# EAGLE schematic am-1801 (EAGLE 6.4)
AUTHOR: Brad Campbell; REV: B; TITLE: Impulse

## Sheet 1 of 2
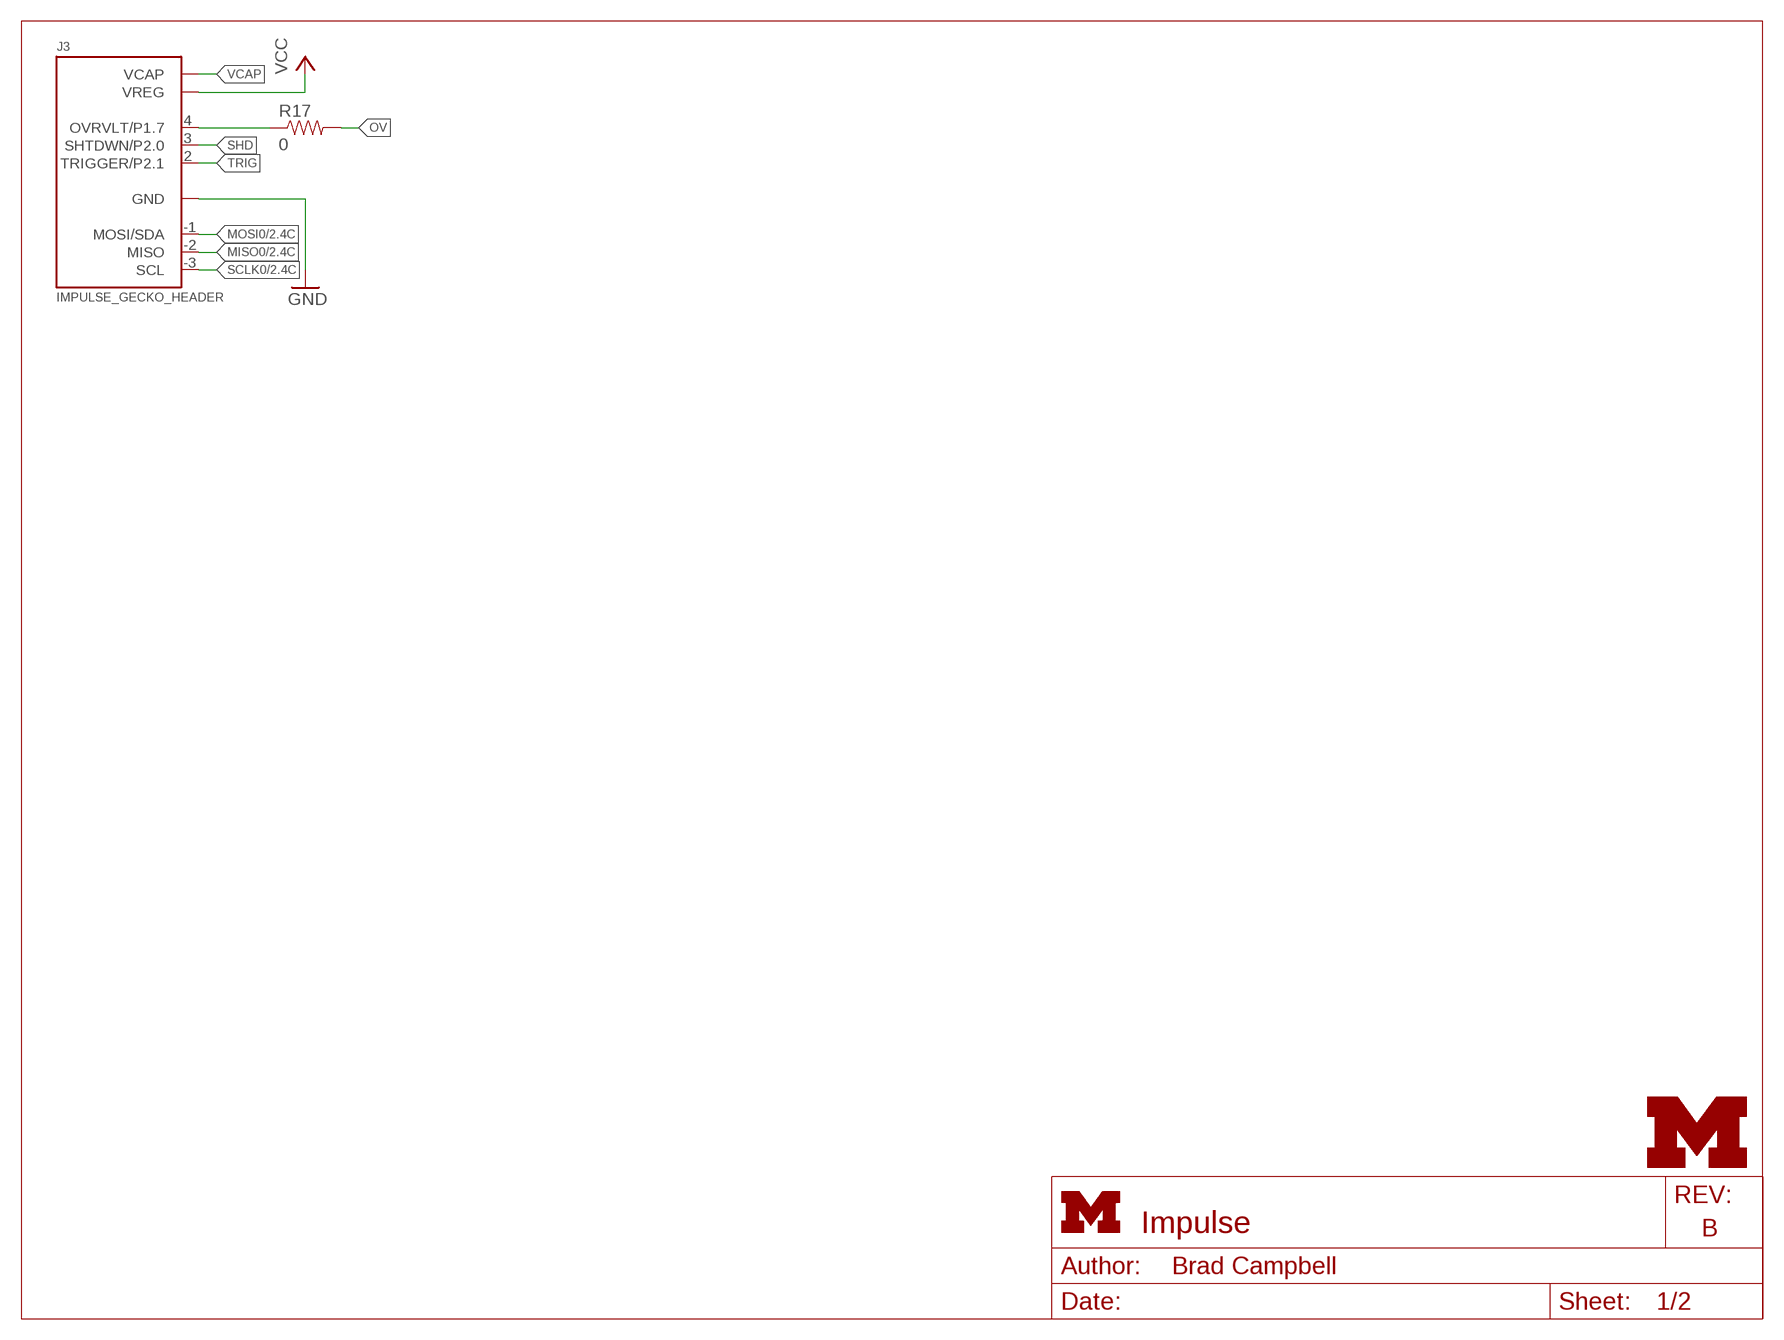
[diagram p0: schematic, sheet 1]
FRAME1 (LETTER_L): HEIGHT: 8.5in; WIDTH: 11in

### Parts
J3  IMPULSE_GECKO_HEADER  [HEADER1X9/0.05IN]
R17  0  RESISTOR  [0402_RES]
U$1  UMICH_SOLID_SMALL  [UMICH_SOLID_75MIL]

### Nets
GND: J3.0(GND) ; also sheet 2
MISO0: J3.-2(MISO) ; also sheet 2
MOSI0: J3.-1(MOSI/SDA) ; also sheet 2
OV: R17.2
OV-HEADER: J3.4(OVRVLT/P1.7) R17.1
SCLK0: J3.-3(SCL) ; also sheet 2
SHD: J3.3(SHTDWN/P2.0)
TRIG: J3.2(TRIGGER/P2.1)
VCAP: J3.5(VCAP)
VCC: J3.1(VREG) ; also sheet 2

## Sheet 2 of 2
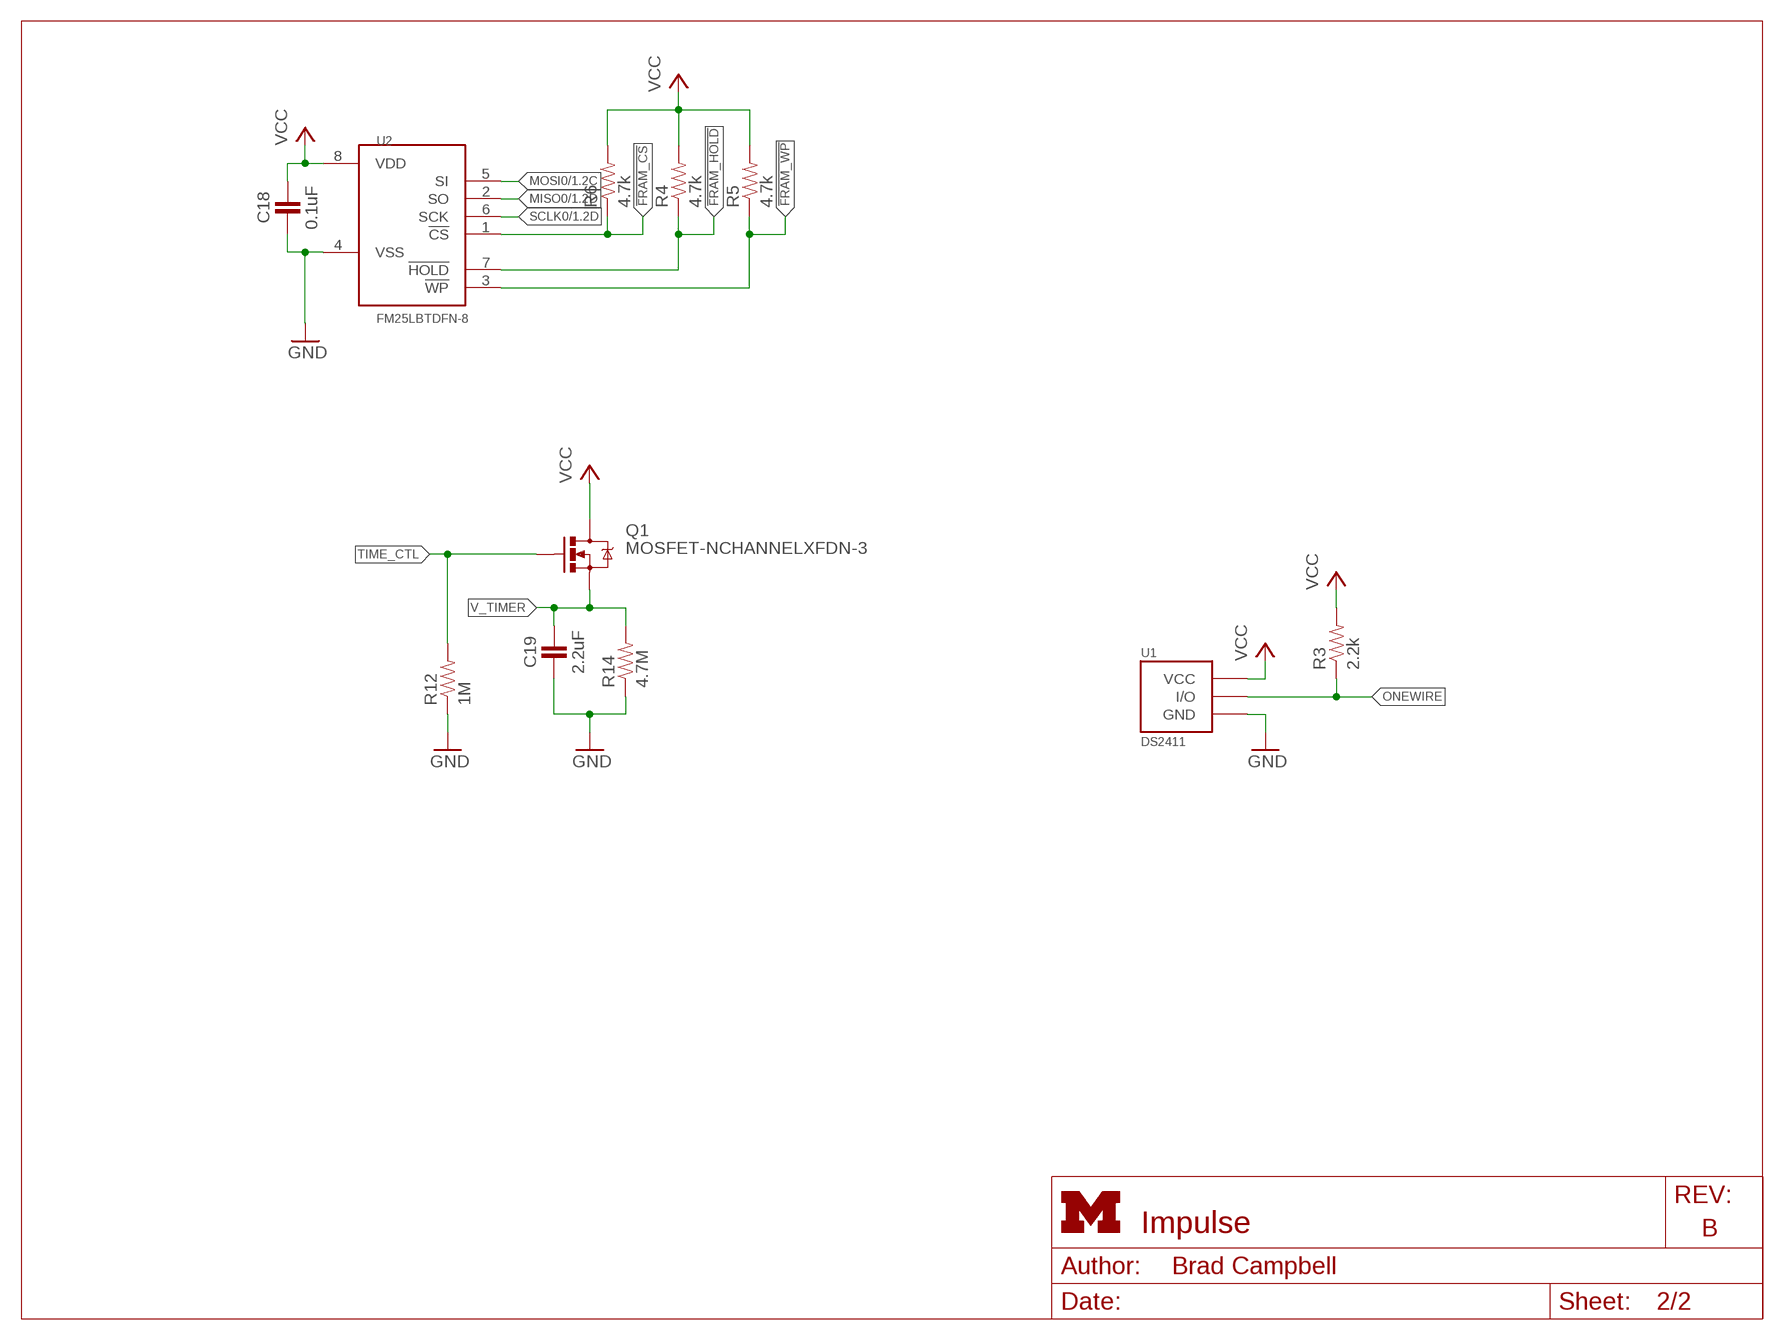
[diagram p1: schematic, sheet 2]
FRAME2 (LETTER_L): HEIGHT: 8.5in; WIDTH: 11in

### Parts
C18  0.1uF  CAPACITOR  [0402_CAP]
C19  2.2uF  CAPACITOR  [0402_CAP]
Q1  MOSFET-NCHANNELXFDN-3  [XFDFN-3]
R3  2.2k  RESISTOR  [0402_RES]
R4  4.7k  RESISTOR  [0402_RES]
R5  4.7k  RESISTOR  [0402_RES]
R6  4.7k  RESISTOR  [0402_RES]
R12  1M  RESISTOR  [0402_RES]
R14  4.7M  RESISTOR  [0402_RES]
U1  DS2411  [SOT-23]
U2  FM25LBTDFN-8  [TDFN-8]

### Nets
!FRAM_CS: R6.1 U2.1(!CS)
!FRAM_HOLD: R4.1 U2.7(!HOLD)
!FRAM_WP: R5.1 U2.3(!WP)
GND: C18.2 C19.2 R12.1 R14.1 U1.3(GND) U2.4(VSS) ; also sheet 1
MISO0: U2.2(SO) ; also sheet 1
MOSI0: U2.5(SI) ; also sheet 1
ONEWIRE: R3.1 U1.1(I/O)
SCLK0: U2.6(SCK) ; also sheet 1
TIME_CTL: Q1.G R12.2
V_TIMER: C19.1 Q1.S R14.2
VCC: C18.1 Q1.D R3.2 R4.2 R5.2 R6.2 U1.2(VCC) U2.8(VDD) ; also sheet 1

## Library data of the parts
C18 C19 = passives:CAPACITOR: 0402 Capacitor
J3 = gecko:IMPULSE_GECKO_HEADER: Header on the impulse EPIC-esque board.
Q1 = fets:MOSFET-NCHANNEL: Generic NMOS footprint; DIGIKEY: DMN2400UFB4-7DICT-ND
R3-R6 R12 R14 R17 = passives:RESISTOR: Resistor Basic schematic elements and footprints for 0603, 1206, and PTH resistors.
U1 = chips:DS2411: Maxim DS2411 Silicon Serial Number with VCC Input; DIGIKEY: DS2411R+CT-ND
U2 = chips:FM25LB: IC FRAM 4KBIT 10MHZ 8SOIC; DIGIKEY: FM25L04B-DGRA-ND; MOUSER: 877-FM25L04B-DG
U$1 = logos:UMICH_SOLID